# Altium schematic sheet LCD.SchDoc
size A4; DocumentNumber: 4; SheetNumber: 4
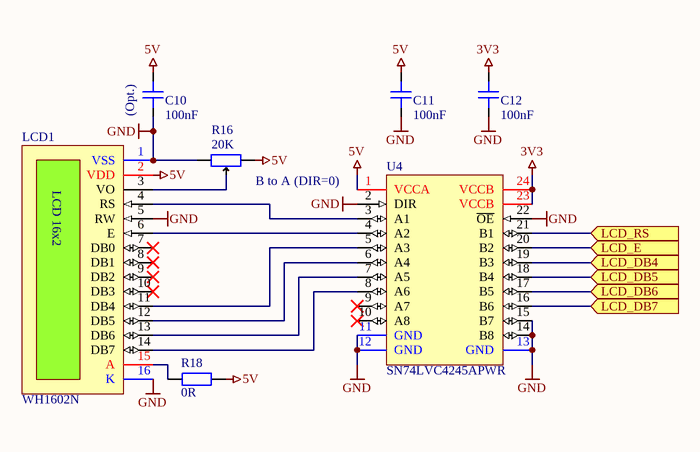
[diagram p0: LCD.SchDoc]

## Parts
C10  100nF  [0603C_RF_M]
C11  100nF  [0603C_RF_M]
C12  100nF  [0603C_RF_M]
LCD1  WH1602N  [PINHDR-16P1-2.54]
R16  20K  [BOURNS_3362P]
R18  0R  [0603R_RF_M]
U4  SN74LVC4245APWR  [TI_TSSOP-24]

## Ports
LCD_DB4 (in), LCD_DB5 (in), LCD_DB6 (in), LCD_DB7 (in), LCD_E (in), LCD_RS (in)

## Nets
3V3: C12.2 U4.23(VCCB) U4.24(VCCB)
5V: C10.2 C11.2 LCD1.2(VDD) R16.1 R18.1 U4.1(VCCA)
GND: C10.1 C11.1 C12.1 LCD1.1(VSS) LCD1.5(RW) LCD1.16(K) R16.2 U4.2(DIR) U4.11(GND) U4.12(GND) U4.13(GND) U4.14(B8) U4.15(B7) U4.22(~{OE})
LCD_DB4: U4.19(B3) ; port LCD_DB4
LCD_DB5: U4.18(B4) ; port LCD_DB5
LCD_DB6: U4.17(B5) ; port LCD_DB6
LCD_DB7: U4.16(B6) ; port LCD_DB7
LCD_E: U4.20(B2) ; port LCD_E
LCD_RS: U4.21(B1) ; port LCD_RS
NetLCD1_3: LCD1.3(VO) R16.3
NetLCD1_4: LCD1.4(RS) U4.3(A1)
NetLCD1_6: LCD1.6(E) U4.4(A2)
NetLCD1_11: LCD1.11(DB4) U4.5(A3)
NetLCD1_12: LCD1.12(DB5) U4.6(A4)
NetLCD1_13: LCD1.13(DB6) U4.7(A5)
NetLCD1_14: LCD1.14(DB7) U4.8(A6)
NetLCD1_15: LCD1.15(A) R18.2

Not connected (* = marked no-connect by the designer): LCD1 7(DB0)* 8(DB1)* 9(DB2)* 10(DB3)*; U4 9(A7)* 10(A8)*

## Notes on the sheet
- (near C10) (Opt.)
- (near R16) B to A (DIR=0)
- Author
- Date
- Revision
- Size
- A4
- Sheet
- of
- (in symbol WH1602N) LCD 16x2

## Library data of the parts
C10-C12 = C: Capacitor; Manufacturer: Generic Brand; Max Voltage: ? V; Value: 100nF; Tolerance: ?; Manufacturer Part No: *; Supplier: *; Supplier Link: http://; Supplier Part No: *; Category: Capacitor; Mounting Technology: SMT
LCD1 = WH1602N: Dot Matrix Character LCD Module 16x2; Manufacturer: Winstar; Manufacturer Part No: WH1602B-YYH-CTK; Supplier Link: https://www.chipdip.by/product/wh1602b-yyh-ctk; Supplier: Chipdip; Supplier Part No: 9000032691; Mounting Technology: THT
R16 = POT: Generic Potentiometer / Variable Resistor; Tolerance: 1%; Value: 20K; Tag: *; Mounting Type: THT; Manufacturer: *; Manufacturer Part No: *; Supplier: *; Supplier Link: http://; Supplier Part No: *
R18 = R: Resistor; Manufacturer: Generic Brand; Max Voltage: ? V; Power Rating: ? W; Value: 0R; Tolerance: ?; Manufacturer Part No: *; Supplier: *; Supplier Link: http://; Supplier Part No: *; Category: Resistor; Mounting Technology: SMT
U4 = SN74LVC4245APWR: Octal Bus Transceiver And 3.3-V To 5-V Shifter With 3-State Outputs; Manufacturer: Texas Instruments; Supplier: Chipdip; Supplier Link: https://www.chipdip.by/product/sn74lvc4245apwr; Supplier Part No: 9000247069; Manufacturer Part No: SN74LVC4245APWR